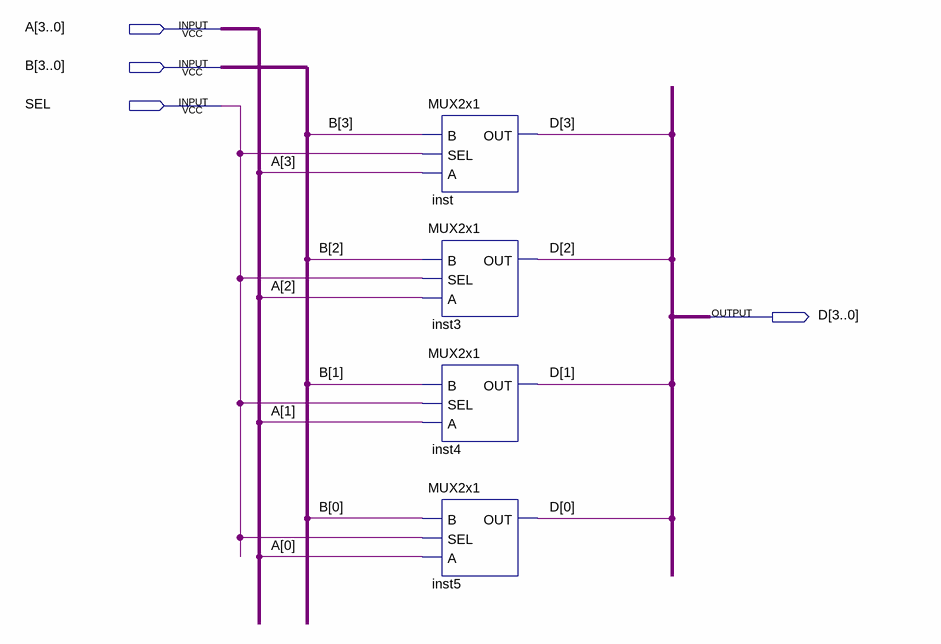
[diagram p0: schematic sheet]
// Quartus schematic Task6.bdf as structural Verilog: 4 symbols, 4 pins
module Task6 (
  input  [3:0] A,
  input  [3:0] B,
  input  SEL,
  output [3:0] D
);

  MUX2x1 inst (.B(B[3]), .SEL(SEL), .A(A[3]), .OUT(D[3]));
  MUX2x1 inst3 (.B(B[2]), .SEL(SEL), .A(A[2]), .OUT(D[2]));
  MUX2x1 inst4 (.B(B[1]), .SEL(SEL), .A(A[1]), .OUT(D[1]));
  MUX2x1 inst5 (.B(B[0]), .SEL(SEL), .A(A[0]), .OUT(D[0]));
endmodule
